# EAGLE design akabeacon_circle_ble113 (EAGLE 7.2.0)
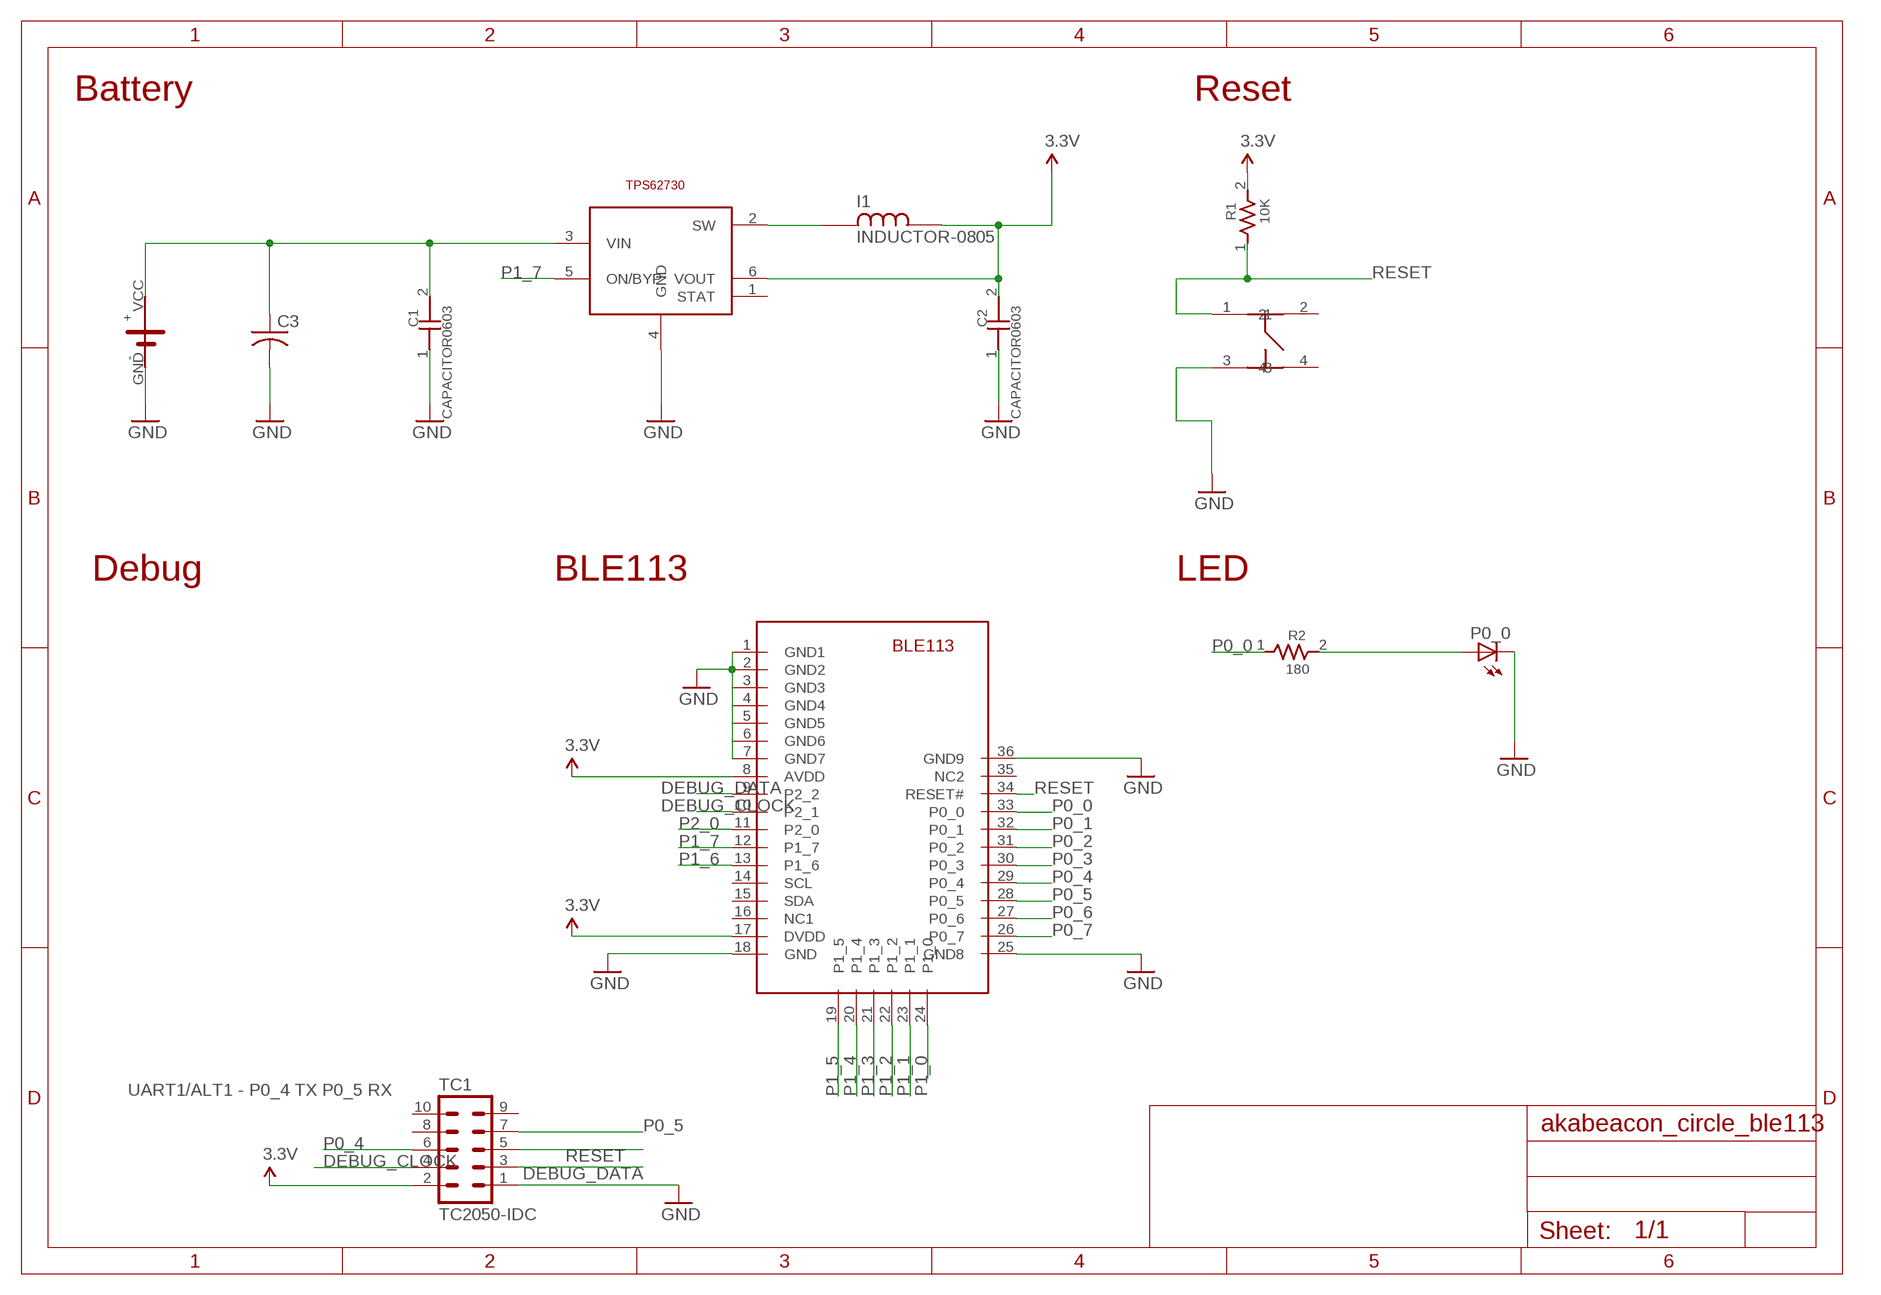
[diagram p0: schematic, sheet 1]

## Parts
C1  CAPACITOR0603  [0603]
C2  CAPACITOR0603  [0603]
C3  C-USC3225  [C3225]
I1  INDUCTOR-0805  [INDUCTOR-0805]
P0_0  LEDCHIP-LED0603  [CHIP-LED0603]
R1  10K  RESISTOR0603  [0603]
R2  180  RESISTOR0603  [0603]
TC1  TC2050-IDC  [TC2050-IDC-NL]
TPS1  TI-TPS62730  [TI-TPS62730]
U$1  CIRCLE-TYPE1  [CIRCLE-TYE1-TC2030]
U$4  BLE113  [BLE113]
U$5  SWICTH-4P(KMR2)  [SWITCH-4P(KMR2)]

## Nets
3.3V: C2.2 I1.P$2 R1.2 TC1.2 TPS1.6(VOUT) U$4.8(AVDD) U$4.17(DVDD)
DEBUG_CLOCK: TC1.4 U$4.10(P2_1)
DEBUG_DATA: TC1.3 U$4.9(P2_2)
GND: C1.1 C2.1 C3.2 P0_0.C TC1.1 TPS1.4(GND) U$1.GND U$4.1(GND1) U$4.2(GND2) U$4.3(GND3) U$4.4(GND4) U$4.5(GND5) U$4.6(GND6) U$4.7(GND7) U$4.18(GND) U$4.25(GND8) U$4.36(GND9) U$5.3
N$1: C1.2 C3.1 TPS1.3(VIN) U$1.VCC
N$5: I1.P$1 TPS1.2(SW)
P0_0: R2.1 U$4.33(P0_0)
P0_1: U$4.32(P0_1)
P0_2: U$4.31(P0_2)
P0_3: U$4.30(P0_3)
P0_4: TC1.6 U$4.29(P0_4)
P0_5: TC1.7 U$4.28(P0_5)
P0_6: U$4.27(P0_6)
P0_7: U$4.26(P0_7)
P1_0: U$4.24(P1_0)
P1_1: U$4.23(P1_1)
P1_2: U$4.22(P1_2)
P1_3: U$4.21(P1_3)
P1_4: U$4.20(P1_4)
P1_5: U$4.19(P1_5)
P1_6: U$4.13(P1_6)
P1_7: TPS1.5(ON/BYP) U$4.12(P1_7)
P2_0: U$4.11(P2_0)
R2: P0_0.A R2.2
RESET: R1.1 TC1.5 U$4.34(RESET#) U$5.1
Unconnected: TC1.8 TC1.9 TC1.10 TPS1.1(STAT) U$4.14(SCL) U$4.15(SDA) U$4.16(NC1) U$4.35(NC2) U$5.2 U$5.4

## Notes on the sheet
- Battery | Reset
- Debug | BLE113 | LED
- UART1/ALT1 - P0_4 TX P0_5 RX

## Library data of the parts
C1 C2 = GClue-Capacitor:CAPACITOR
C3 = rcl:C-US: CAPACITOR, American symbol
I1 = gclueParts:INDUCTOR-0805
P0_0 = led:LED: LED OSRAM: - CHIPLED LG R971, LG N971, LY N971, LG Q971, LY Q971, LO R971, LY R971 LH N974, LH R974 LS Q976, LO Q976, LY Q976 LO Q996 - Hyper CHIPLED LW Q18S LB Q993, LB Q99A, LB R99A - SideLED LS A670, LO A670, LY A670, LG A670, LP A670 LB A673, LV A673, LT A673, LW A673 LH A674 LY A675 LS A676, LA A676, LO A676, LY A676, LW A676 LS A679, LY A679, LG A679 - Hyper Micro SIDELED® LS Y876, LA Y876, LO Y876, LY Y876 LT Y87S - SmartLED LW L88C, LW L88S LB L89C, LB L89S, LG L890 LS L89K, LO L89K, LY L89K LS L896, LA L896, LO L896, LY L896 - TOPLED LS T670, LO T670, LY T670, LG T670, LP T670 LSG T670, LSP T670, LSY T670, LOP T670, LYG T670 LG T671, LOG T671, LSG T671 LB T673, LV T673, LT T673, LW T673 LH T674 LS T676, LA T676, LO T676, LY T676, LB T676, LH T676, LSB T676, LW T676 LB T67C, LV T67C, LT T67C, LS T67K, LO T67K, LY T67K, LW E67C LS E67B, LA E67B, LO E67B, LY E67B, LB E67C, LV E67C, LT E67C LW T67C LS T679, LY T679, LG T679 LS T770, LO T770, LY T770, LG T770, LP T770 LB T773, LV T773, LT T773, LW T773 LH T774 LS E675, LA E675, LY E675, LS T675 LS T776, LA T776, LO T776, LY T776, LB T776 LHGB T686 LT T68C, LB T68C - Hyper Mini TOPLED® LB M676 - Mini TOPLED Santana® LG M470 LS M47K, LO M47K, LY M47K Source: http://www.osram.convergy.de LUXEON: - LUMILED® LXK2-PW12-R00, LXK2-PW12-S00, LXK2-PW14-U00, LXK2-PW14-V00 LXK2-PM12-R00, LXK2-PM12-S00, LXK2-PM14-U00 LXK2-PE12-Q00, LXK2-PE12-R00, LXK2-PE12-S00, LXK2-PE14-T00, LXK2-PE14-U00 LXK2-PB12-K00, LXK2-PB12-L00, LXK2-PB12-M00, LXK2-PB14-N00, LXK2-PB14-P00, LXK2-PB14-Q00 LXK2-PR12-L00, LXK2-PR12-M00, LXK2-PR14-Q00, LXK2-PR14-R00 LXK2-PD12-Q00, LXK2-PD12-R00, LXK2-PD12-S00 LXK2-PH12-R00, LXK2-PH12-S00 LXK2-PL12-P00, LXK2-PL12-Q00, LXK2-PL12-R00 Source: www.luxeon.com KINGBRIGHT: KA-3528ASYC Source: www.kingbright.com
R1 R2 = GClue-Resistors:RESISTOR
TC1 = TagConnect:TC2050-IDC: Tag-Connect In Circuit Programming & Debug Cable 10 Pin http://www.tag-connect.com
TPS1 = gclueSupply:TI-TPS62730
U$1 = GClue-Beacon:CIRCLE-TYPE1
U$4 = gclue:BLE113
U$5 = gclue-test:SWICTH-4P(KMR2)

## Board
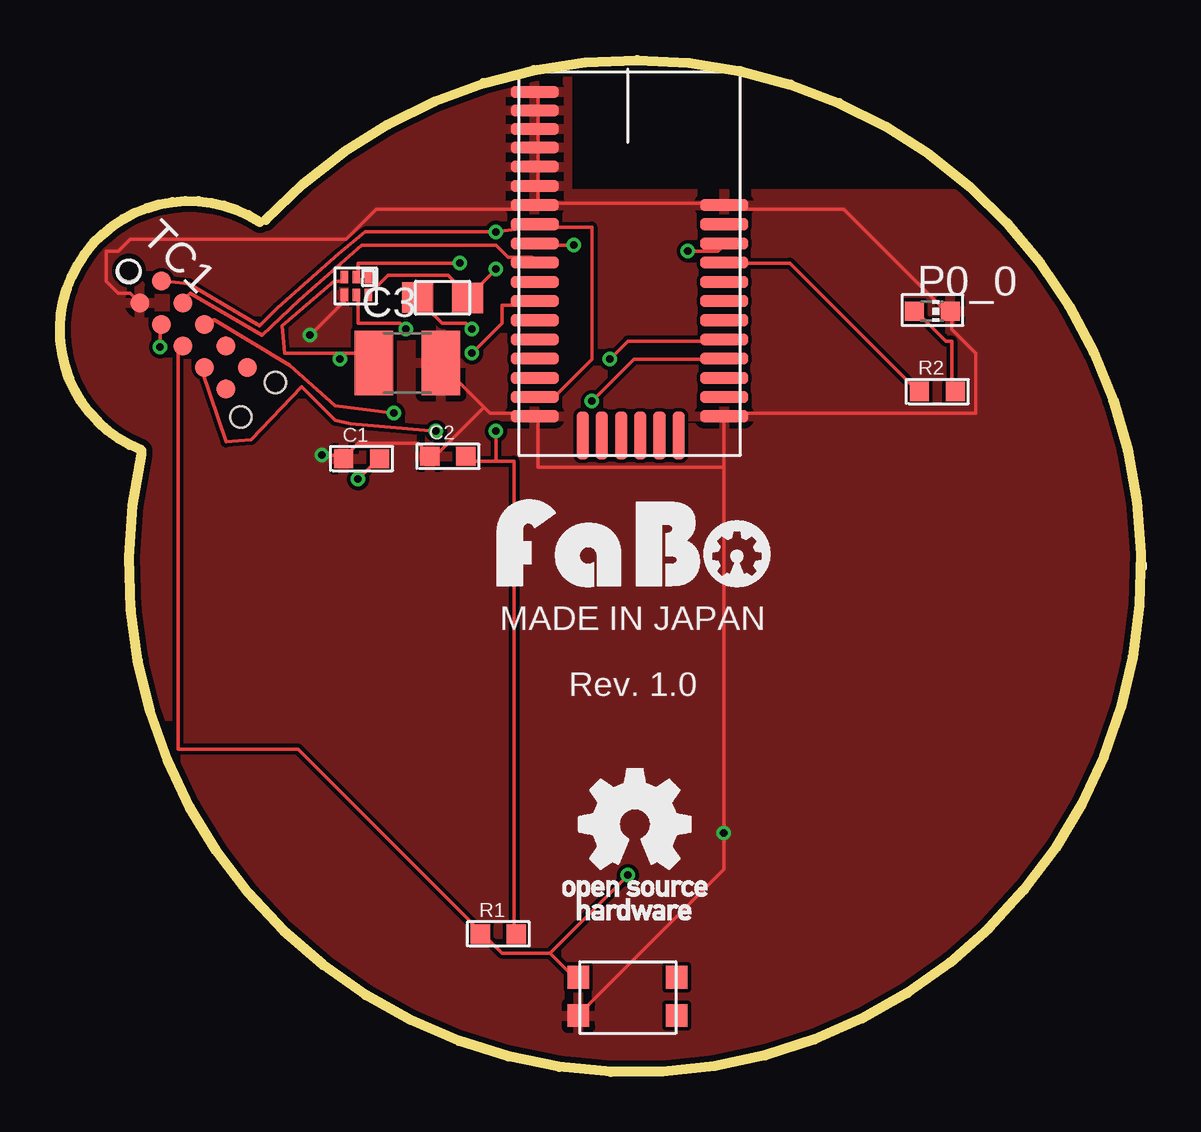
[diagram p1: board, top side]
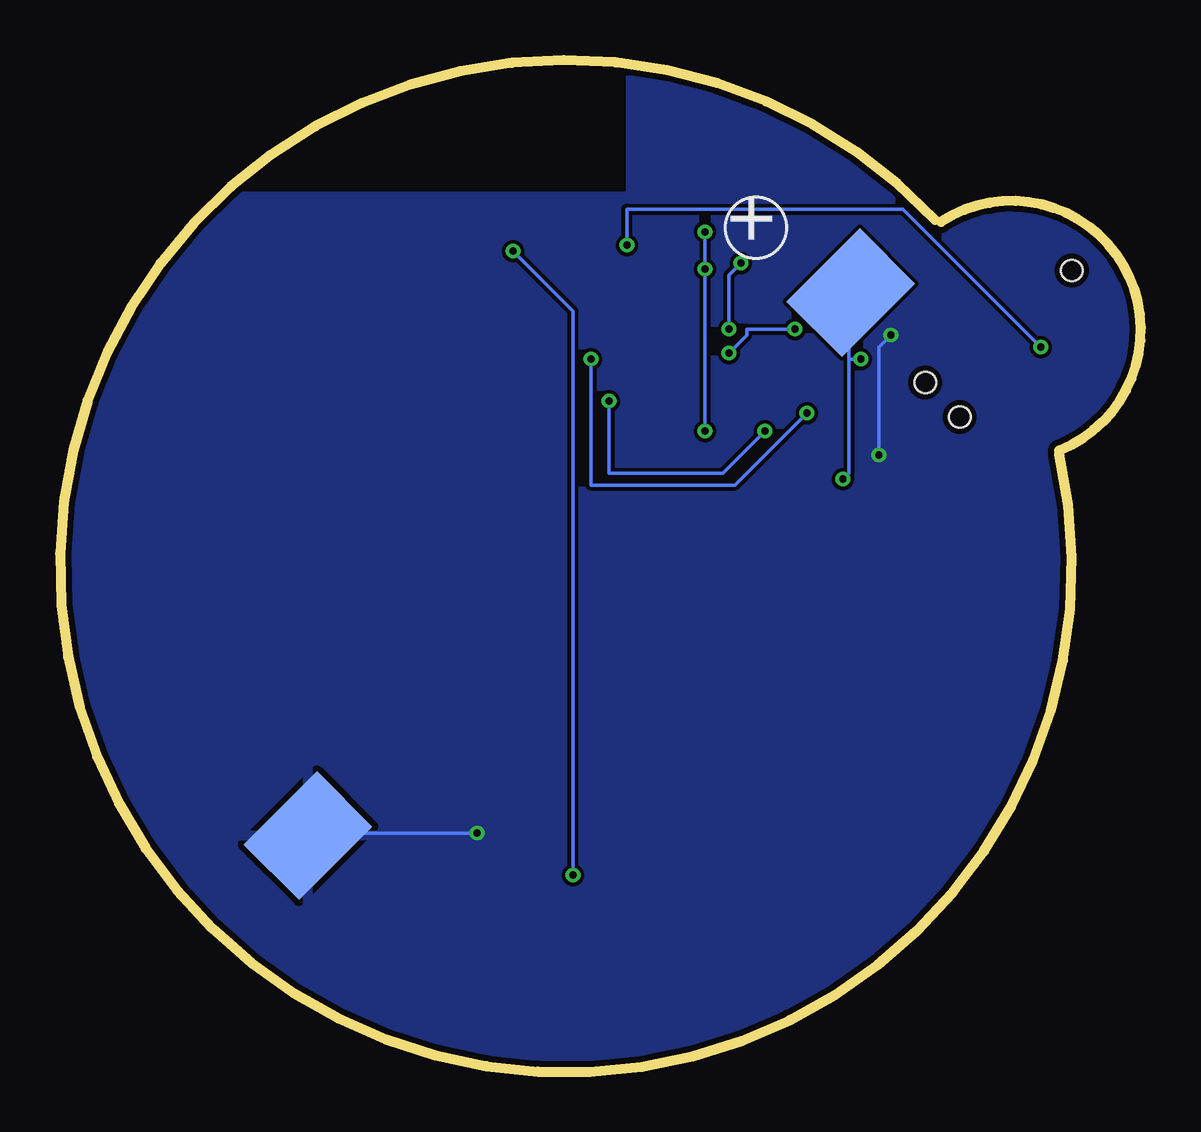
[diagram p2: board, bottom side, seen from below]

Size 45.05 x 42.16 mm. Coordinates in mm from the lower left corner, seen from the top.
Copper layers (1*16): Top 0.035mm / dielectric 1.5mm / Bottom 0.035mm
Design rules "SeeedStudio_2layer_DRU_no_angle_20140221": minimum track width 6mil, minimum drill 12mil, track to track 6mil, track to pad 6mil, pad to pad 6mil, via to via 6mil, smd to smd 0mil, copper to edge 10mil, drill to drill 10mil, minimum pad ring 10mil, minimum via ring 6mil, stop-mask expansion 2mil, vias tented up to drill 100mil, thermal gap 10mil
tRestrict: area 21.4,36.8 to 39.6,43.8
bRestrict: area 21.5,36.7 to 40,43.7

### Footprints (pad centres in the part's own frame; a part is rotated, then mirrored left to right if it is on the bottom)
0603 = smd 0.8 x 0.8: 1 -0.75,0; 2 0.75,0
C3225 = smd 1.6 x 2.7: 1 -1.4,0; 2 1.4,0
INDUCTOR-0805 = smd 1.3 x 1.27: P$1 -1.04,0.02; P$2 1.04,0.01
CHIP-LED0603 = smd 0.8 x 0.8: A 0,-0.75; C 0,0.75
TC2050-IDC-NL = smd 0.787 x 0.787: 1 -2.54,-0.635; 2 -2.54,0.635; 3 -1.27,-0.635; 4 -1.27,0.635; 5 0,-0.635; 6 0,0.635; 7 1.27,-0.635; 8 1.27,0.635; 9 2.54,-0.635; 10 2.54,0.635 | hole 0.889: -3.81,0; 3.81,-1.016; 3.81,1.016
TI-TPS62730 = smd 0.3 x 0.52: 1 0.48,0.25; 2 -0.02,0.25; 3 -0.52,0.25; 4 -0.52,-0.5; 5 -0.02,-0.5; 6 0.48,-0.5
CIRCLE-TYE1-TC2030 = smd 4.318 x 3.251 rotated 135 bottom: GND 11.046,-11.107; VCC -11.581,11.521
BLE113 = smd 2 x 0.5: 1 -5.08,5.08; 2 -5.08,4.31; 3 -5.08,3.54; 4 -5.08,2.77; 5 -5.08,1.97; 6 -5.08,1.17; 7 -5.08,0.37; 8 -5.08,-0.43; 9 -5.08,-1.23; 10 -5.08,-2.03; 11 -5.08,-2.83; 12 -5.08,-3.63; 13 -5.08,-4.43; 14 -5.08,-5.23; 15 -5.08,-6.03; 16 -5.08,-6.83; 17 -5.08,-7.63; 18 -5.08,-8.43; 25 2.82,-8.43; 26 2.82,-7.63; 27 2.82,-6.83; 28 2.82,-6.03; 29 2.82,-5.23; 30 2.82,-4.43; 31 2.82,-3.63; 32 2.82,-2.83; 33 2.82,-2.03; 34 2.82,-1.23; 35 2.82,-0.43; 36 2.82,0.37 | smd 0.5 x 2: 19 -3.08,-9.23; 20 -2.28,-9.23; 21 -1.48,-9.23; 22 -0.68,-9.23; 23 0.12,-9.23; 24 0.92,-9.23
SWITCH-4P(KMR2) = smd 0.9 x 0.95: 1 -1,0; 2 3.1,0; 3 -1,-1.6; 4 3.1,-1.6

### Placement (x,y rotation side)
C1  12.57,25.55 0 top
C2  16.17,25.65 0 top
C3  14.48,29.54 0 top
I1  15.95,32.24 0 top
P0_0  36.36,31.7 270 top
R1  18.27,5.75 0 top
R2  36.57,28.35 0 top
TC1  5.57,30.7 315 top
TPS1  12.37,32.88 0 top
U$1  23.67,20.95 0 top
U$2  [LOGO_FABO_M]  23.92,20.2 0 top
U$4  24.87,35.75 0 top
U$5  22.61,3.95 0 top
U$7  [LOGO_OSHW_T_M]  23.97,10.3 0 top

### Tracks (layer width: path | path; a pad name or v marks a point on that pad's centre or on a via)
3.3V  (via drill 0.3)
  Top 0.152: 18.17,25.45 16.92,25.45 C2.2 | 18.17,25.45 18.92,25.45 18.92,5.95 R1.2 | TPS1.6 13.67,33.2 16.17,33.2 16.92,32.45 I1.P$2 17.17,32.45 v18.17,33.45 | TC1.2 4.42,32.95 5.37,32.85 8.32,31.1 9.07,31.85 11.62,34.1 12.72,35 v18.17,35 19.67,35.2 U$4.8 19.92,35.2 22.17,35.2 22.17,29.7 20.67,28.2 19.92,28.2 U$4.17 | v18.17,26.7 18.17,25.45
  Bottom 0.152: v18.17,35 v18.17,33.45 v18.17,26.7
DEBUG_CLOCK
  Top 0.152: TC1.4 5.17,32.2 5.42,32.45 8.42,30.7 9.97,32.15 12.57,34.45 18.17,34.45 18.67,33.95 19.67,33.95 U$4.10
DEBUG_DATA  (via drill 0.3)
  Top 0.152: v4.17,30.2 4.17,30.95 TC1.3 | v21.42,34.45 19.92,34.45 U$4.9
  Bottom 0.152: v4.17,30.2 9.92,35.95 21.42,35.95 v21.42,34.45
GND  (via drill 0.3)
  Top 0.152: U$4.1 19.92,40.7 19.92,40.2 U$4.2 19.92,39.95 19.92,39.45 U$4.3 19.92,39.2 19.92,38.7 U$4.4 19.92,38.45 19.92,37.95 U$4.5 19.92,37.7 19.92,36.95 U$4.6 19.92,36.7 19.92,36.2 | TC1.1 3.17,32.2 2.92,32.45 2.42,32.45 1.92,32.95 1.92,34.2 2.42,34.2 2.92,34.7 11.92,34.7 13.17,35.95 19.67,35.95 U$4.7 19.92,36.2 | 19.92,36.2 27.67,36.2 U$4.36 27.92,35.95 32.67,35.95 36.92,31.7 P0_0.C 37.17,31.7 37.17,30.95 38.17,29.95 38.17,27.45 27.92,27.45 U$4.25 27.67,27.2 27.67,25.2 | 17.67,27.7 15.92,29.45 C3.2 | 17.67,27.7 17.92,27.45 19.67,27.45 U$4.18 19.92,27.2 19.92,25.2 27.67,25.2 | v10.42,30.7 11.92,32.2 TPS1.4 | v10.92,25.7 11.67,25.7 C1.1 11.92,25.7 12.42,26.2 14.92,26.2 15.42,25.7 | 17.67,27.7 15.67,25.7 15.42,25.7 | 15.42,25.7 C2.1 | 27.67,25.2 v27.67,9.95 27.67,8.45 21.67,2.45 U$5.3
  Bottom 0.152: v10.42,30.7 10.92,30.2 v10.92,25.7 | v27.67,9.95 34.67,9.95 U$1.GND
  pour Top: -0.33,-0.05 45.67,-0.05 45.67,42.95 -0.33,42.95
  pour Bottom: -0.33,-0.05 45.67,-0.05 45.67,42.95 -0.33,42.95
N$1  (via drill 0.3)
  Top 0.152: 11.67,29.95 12.67,29.95 C3.1 | 11.67,29.95 9.37,29.95 9.27,31.1 11.42,32.95 11.92,32.95 TPS1.3 | v12.42,24.7 13.17,25.45 C1.2 | v11.67,29.7 11.67,29.95
  Bottom 0.152: v12.42,24.7 12.17,24.95 12.17,29.7 | 12.17,29.7 12.17,32.45 U$1.VCC | 12.17,29.7 v11.67,29.7
N$5  (via drill 0.3)
  Top 0.152: v16.67,33.7 12.42,33.7 12.42,33.2 TPS1.2 | v17.17,30.95 16.92,31.2 15.92,31.2 14.92,32.2 I1.P$1
  Bottom 0.152: v16.67,33.7 17.17,33.2 v17.17,30.95
P0_0
  Top 0.152: R2.1 35.67,28.45 30.42,33.7 27.92,33.7 U$4.33
P0_4  (via drill 0.3)
  Top 0.152: v13.92,27.45 11.47,27.75 9.57,29.45 6.42,31.35 6.17,31.2 TC1.6 | v22.92,29.7 23.67,30.45 27.67,30.45 U$4.29
  Bottom 0.152: v13.92,27.45 16.92,24.45 22.92,24.45 v22.92,29.7
P0_5  (via drill 0.3)
  Top 0.152: v15.67,26.7 12.12,27 11.47,27.15 10.07,28.55 7.97,26.35 6.92,26.25 5.92,29.2 TC1.7 | v22.17,27.95 23.92,29.7 27.67,29.7 U$4.28
  Bottom 0.152: v15.67,26.7 17.42,24.95 22.17,24.95 v22.17,27.95
P1_7  (via drill 0.3)
  Top 0.152: v14.42,30.95 14.17,31.2 12.42,31.2 12.42,32.2 TPS1.5 | v17.17,29.95 18.42,31.2 18.42,31.95 19.67,31.95 U$4.12
  Bottom 0.152: v14.42,30.95 16.42,30.95 16.42,30.7 v17.17,29.95
R2
  Top 0.152: R2.2 37.17,28.45 37.17,30.45 36.92,30.45 35.67,31.7 P0_0.A
RESET  (via drill 0.3)
  Top 0.152: TC1.5 4.92,30.2 4.92,13.45 9.92,13.45 17.42,5.95 R1.1 17.67,5.7 18.42,4.95 20.42,4.95 | 20.42,4.95 21.42,3.95 U$5.1 | v26.17,34.2 27.42,34.2 27.67,34.45 U$4.34 | 20.42,4.95 v23.67,8.2
  Bottom 0.152: v26.17,34.2 23.67,31.7 v23.67,8.2

### Text on the board
tPlace: MADE IN JAPAN | Rev. 1.0